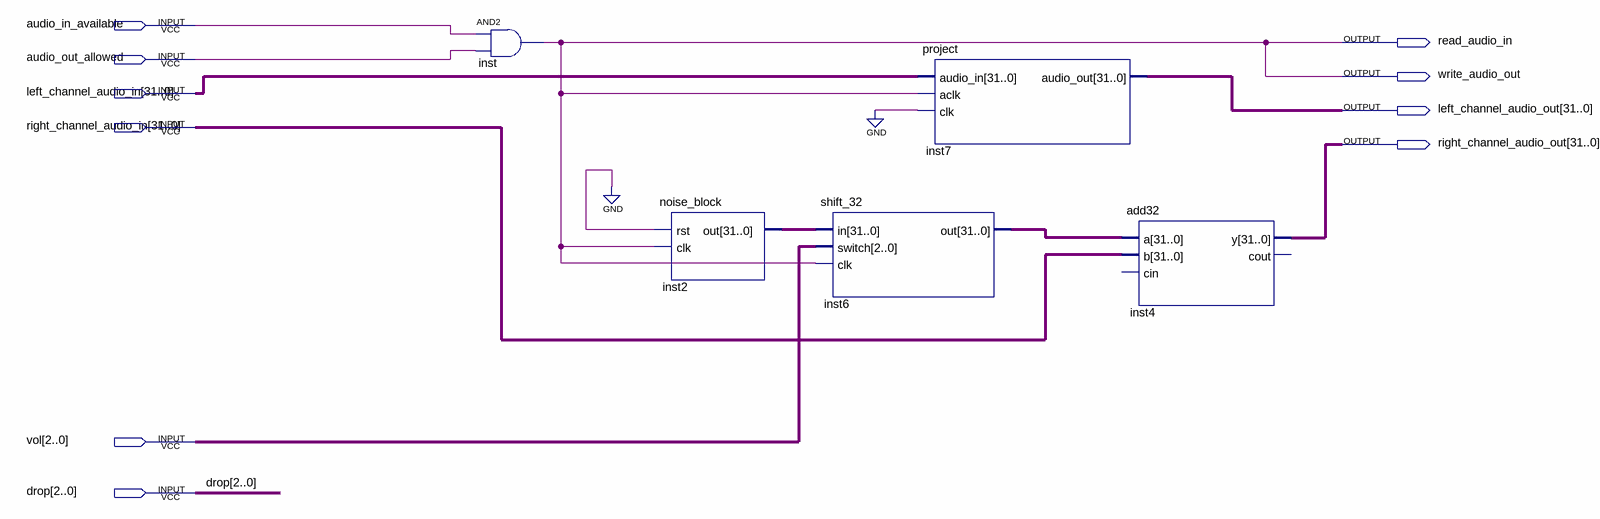
[diagram p0: schematic sheet]
// Quartus schematic filter_demo.bdf as structural Verilog: 5 symbols, 10 pins
module filter_demo (
  input  audio_in_available,
  input  audio_out_allowed,
  input  [31:0] left_channel_audio_in,
  input  [31:0] right_channel_audio_in,
  input  [2:0] vol,
  input  [2:0] drop,
  output read_audio_in,
  output write_audio_out,
  output [31:0] left_channel_audio_out,
  output [31:0] right_channel_audio_out
);

  wire [31:0] inst2_out, inst6_out;

  and inst (read_audio_in, audio_in_available, audio_out_allowed);
  noise_block inst2 (.rst(1'b0), .clk(read_audio_in), .out(inst2_out));
  shift_32 inst6 (.in(inst2_out), .switch(vol), .clk(read_audio_in), .out(inst6_out));
  project inst7 (
    .audio_in(left_channel_audio_in), .aclk(read_audio_in), .clk(1'b0), .audio_out(left_channel_audio_out));
  add32 inst4 (.a(inst6_out), .b(right_channel_audio_in), .y(right_channel_audio_out));  // open: cin, cout

  assign write_audio_out = read_audio_in;
endmodule
